# Altium schematic sheet GPIO.SchDoc
size A4
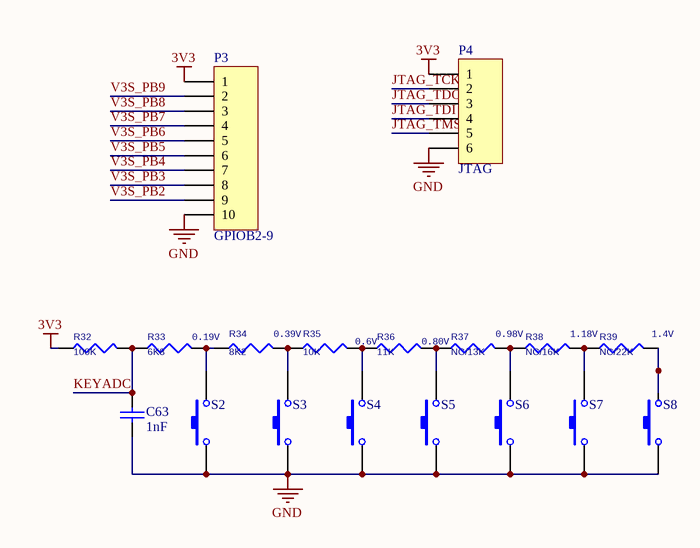
[diagram p0: GPIO.SchDoc]

## Parts
C63  value 1nF  [0603C]  (hidden comment: 103)
P3  GPIOB2-9  [HDR1X10]
P4  JTAG  [HDR1X6]
R32  100K  [0603R]
R33  6K8  [0603R]
R34  8K2  [0603R]
R35  10K  [0603R]
R36  11K  [0603R]
R37  NC/13K  [0603R]
R38  NC/16K  [0603R]
R39  NC/22K  [0603R]
S2  SW-PB  [Switch_SMT-022S-H2.5]  (value not drawn)
S3  SW-PB  [Switch_SMT-022S-H2.5]  (value not drawn)
S4  SW-PB  [Switch_SMT-022S-H2.5]  (value not drawn)
S5  SW-PB  [Switch_SMT-022S-H2.5]  (value not drawn)
S6  SW-PB  [Switch_SMT-022S-H2.5]  (value not drawn)
S7  SW-PB  [Switch_SMT-022S-H2.5]  (value not drawn)
S8  SW-PB  [Switch_SMT-022S-H2.5]  (value not drawn)

## Nets
3V3: P3.1 P4.1 R32.1
GND: C63.2 P3.10 P4.6 S2.1 S3.1 S4.1 S5.1 S6.1 S7.1 S8.1
JTAG_TCK: P4.2
JTAG_TDI: P4.4
JTAG_TDO: P4.3
JTAG_TMS: P4.5
KEYADC: C63.1 R32.2 R33.1
V3S_PB2: P3.9
V3S_PB3: P3.8
V3S_PB4: P3.7
V3S_PB5: P3.6
V3S_PB6: P3.5
V3S_PB7: P3.4
V3S_PB8: P3.3
V3S_PB9: P3.2
NetR33_2: R33.2 R34.1 S2.2
NetR34_2: R34.2 R35.1 S3.2
NetR35_2: R35.2 R36.1 S4.2
NetR36_2: R36.2 R37.1 S5.2
NetR37_2: R37.2 R38.1 S6.2
NetR38_2: R38.2 R39.1 S7.2
NetR39_2: R39.2 S8.2

## Notes on the sheet
- (near R33) 0.19V
- 0.39V
- 0.98V
- 1.18V
- (near R39) 1.4V
- 0.6V
- (near R36) 0.80V

## Library data of the parts
C63 = Cap: 0603 Ceramic Capacitor; Published: 8-Jun-2000; LatestRevisionDate: 17-Jul-2002; LatestRevisionNote: Re-released for DXP Platform.; PackageReference: RAD-0.3; Publisher: Altium Limited; PackageDescription: Radial Cap, Thru-Hole; 2 Leads; 0.3 in Pin Spacing
P3 = Header 10: Header, 10-Pin; LatestRevisionDate: 17-Jul-2002; LatestRevisionNote: Re-released for DXP Platform.; Publisher: Altium Limited
P4 = Header 6: Header, 6-Pin; LatestRevisionDate: 17-Jul-2002; LatestRevisionNote: Re-released for DXP Platform.; Publisher: Altium Limited
R32-R36 = R1 0805_Dup2: Page: 11
R37-R39 = R1 0805
S2-S8 = SW-PB: Switch; Published: 24-Mar-1999; LatestRevisionDate: 17-Jul-2002; LatestRevisionNote: Re-released for DXP Platform.; PackageReference: SPST-2; Publisher: Altium Limited; PackageDescription: Switch; 2 Leads